# EAGLE design Solarduino (EAGLE 7.3.0)
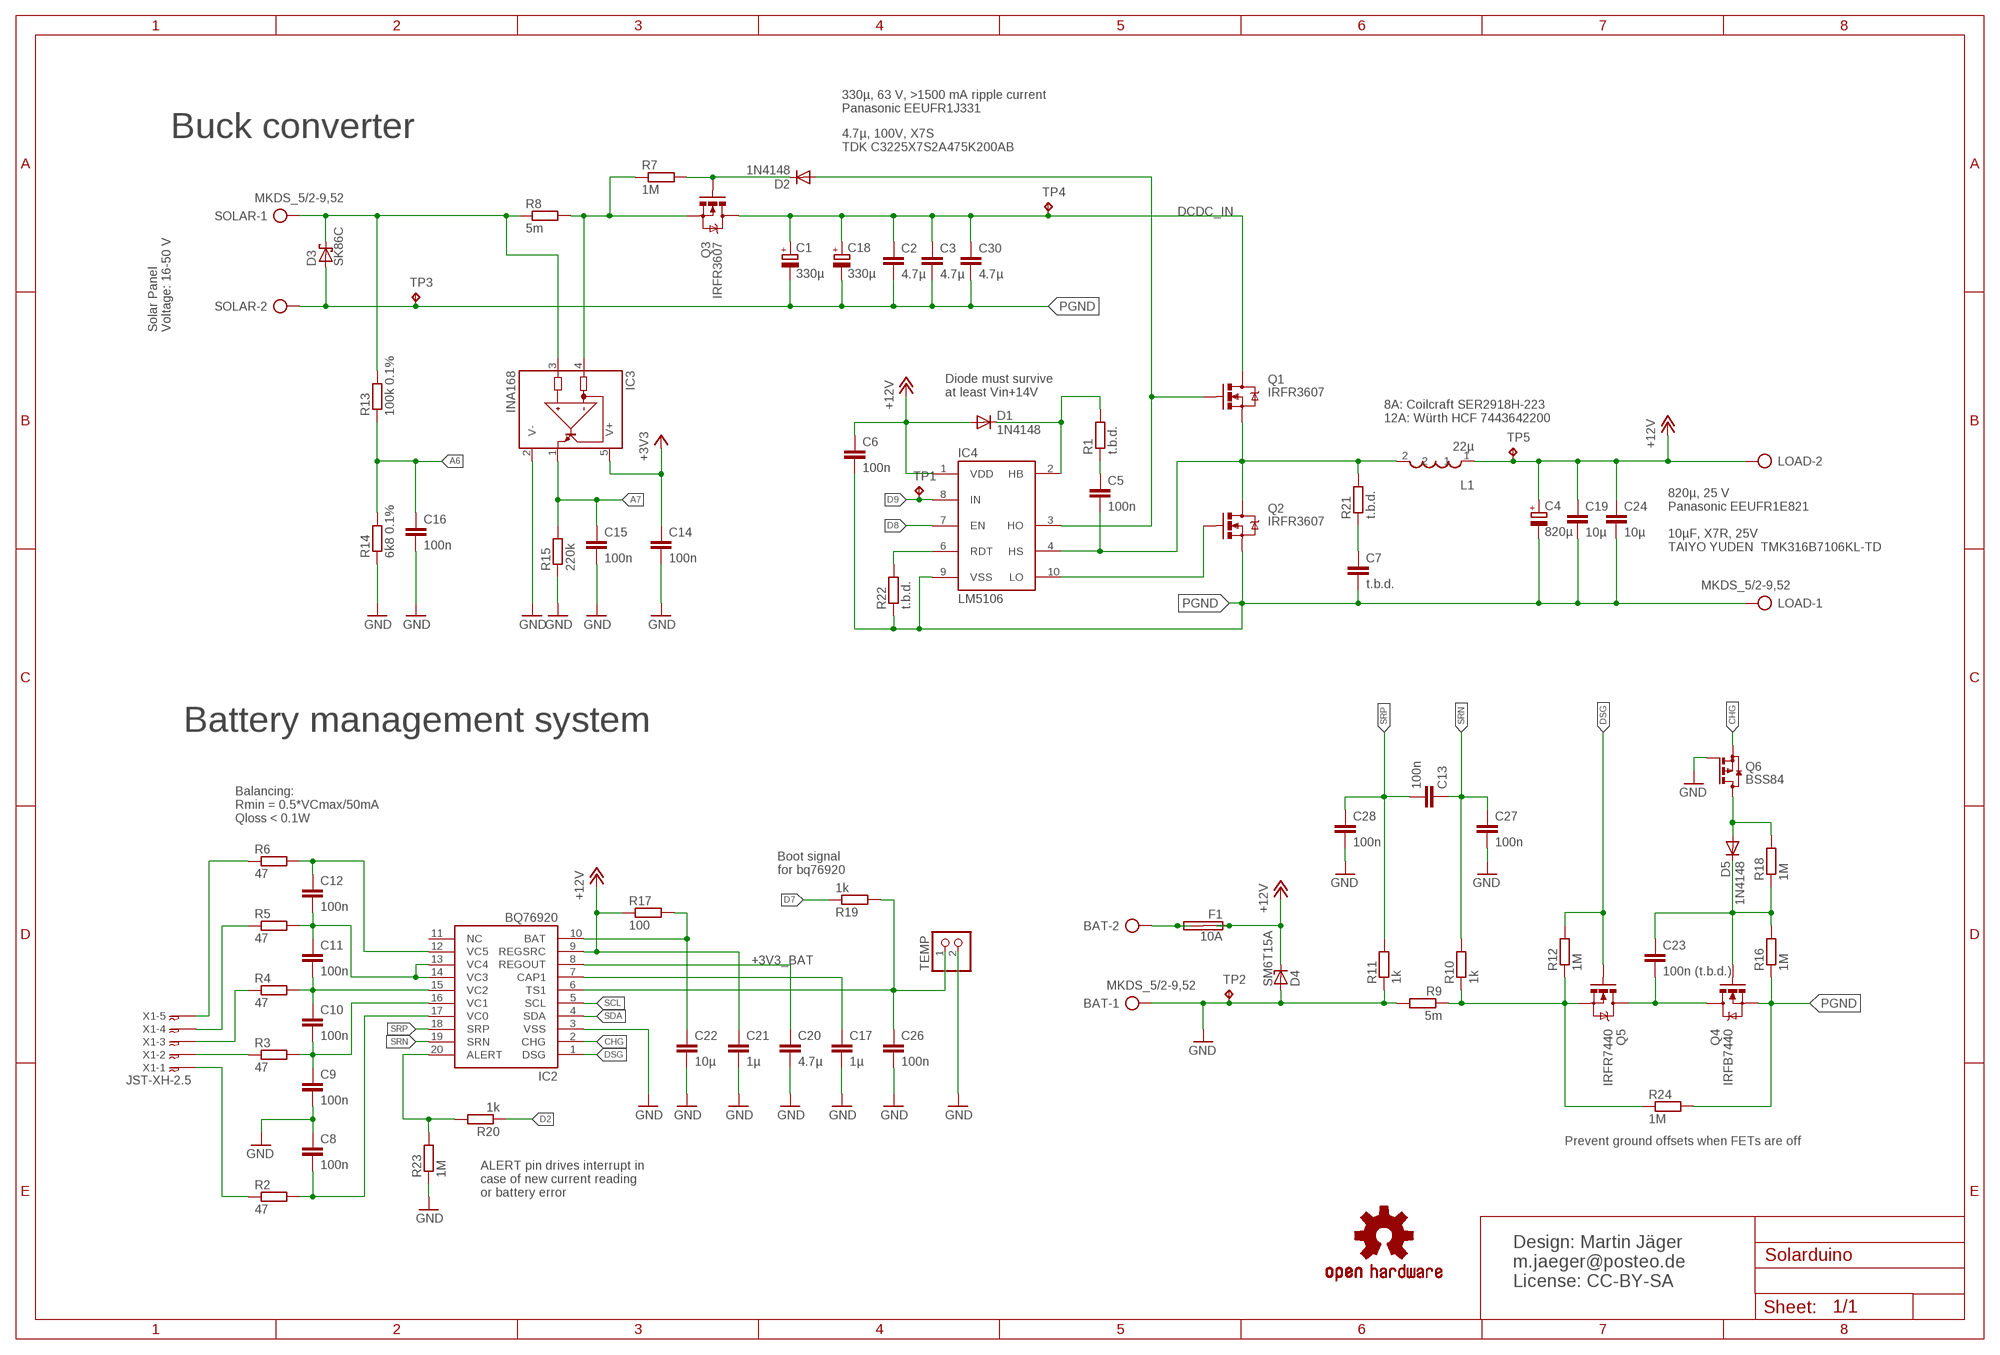
[diagram p0: schematic, sheet 1, part 1 of 2]
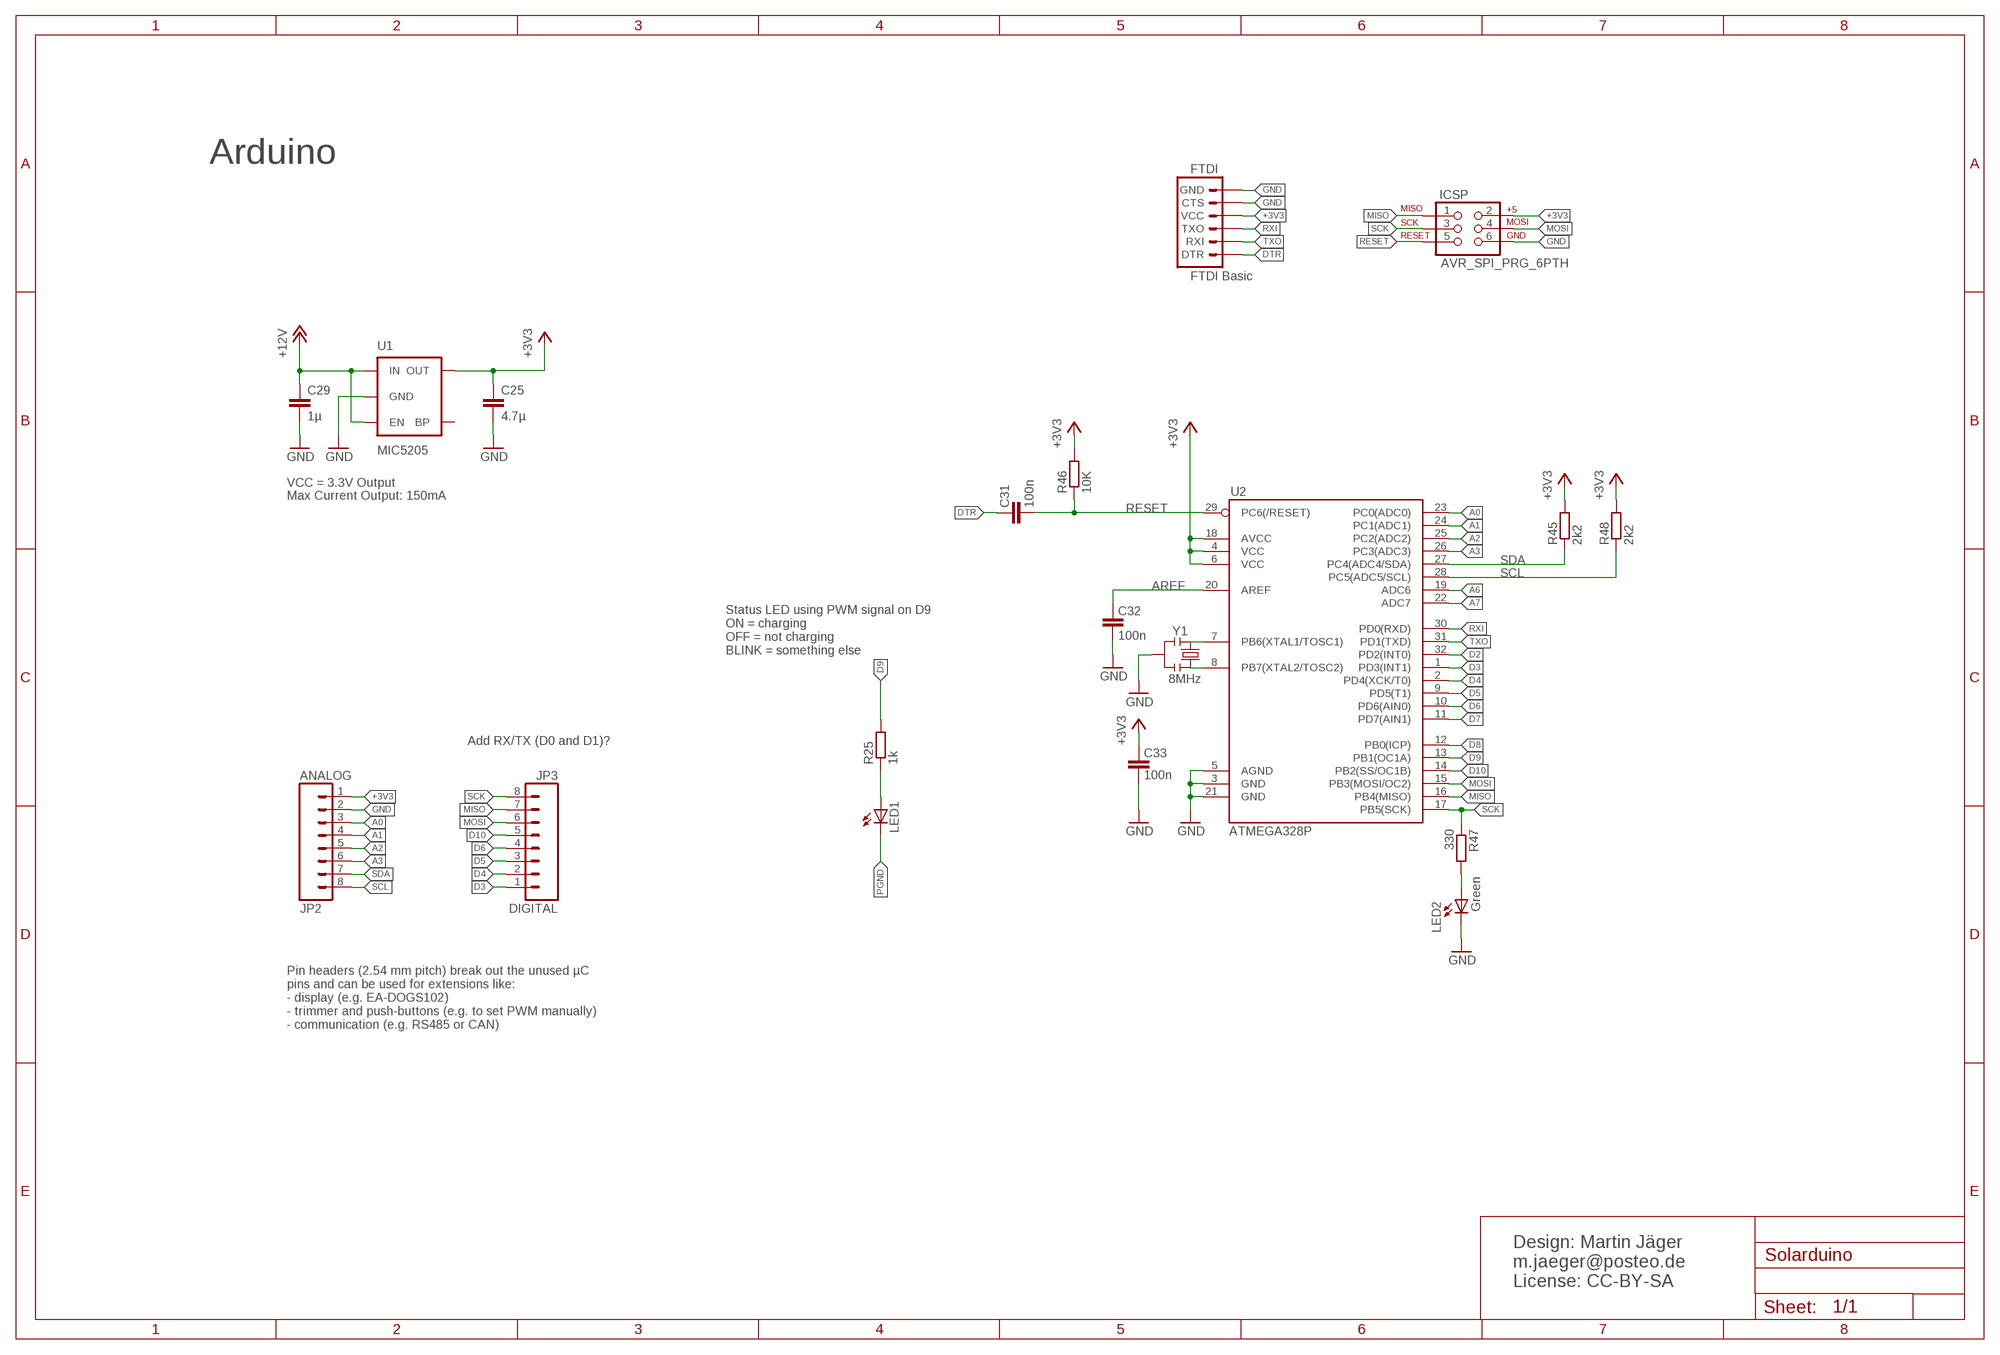
[diagram p1: schematic, sheet 1, part 2 of 2]

## Parts
BAT  MKDS_5/2-9,52  [MKDS_5/2-952]
C1  330µ  CPOL-EUE5-13  [E5-13]
C2  4.7µ  C-EUC1210  [C1210]
C3  4.7µ  C-EUC1210  [C1210]
C4  820µ  CPOL-EUE5-10.5  [E5-10,5]
C5  100n  C-EUC0805  [C0805]
C6  100n  C-EUC0805  [C0805]
C7  t.b.d.  C-EUC0805  [C0805]
C8  100n  C-EUC0805  [C0805]
C9  100n  C-EUC0805  [C0805]
C10  100n  C-EUC0805  [C0805]
C11  100n  C-EUC0805  [C0805]
C12  100n  C-EUC0805  [C0805]
C13  100n  C-EUC0805  [C0805]
C14  100n  C-EUC0805  [C0805]
C15  100n  C-EUC0805  [C0805]
C16  100n  C-EUC0805  [C0805]
C17  1µ  C-EUC0805  [C0805]
C18  330µ  CPOL-EUE5-13  [E5-13]
C19  10µ  C-EUC1206  [C1206]
C20  4.7µ  C-EUC0805  [C0805]
C21  1µ  C-EUC0805  [C0805]
C22  10µ  C-EUC1206  [C1206]
C23  100n (t.b.d.)  C-EUC0805  [C0805]
C24  10µ  C-EUC1206  [C1206]
C25  4.7µ  C-EUC0805  [C0805]
C26  100n  C-EUC0805  [C0805]
C27  100n  C-EUC0805  [C0805]
C28  100n  C-EUC0805  [C0805]
C29  1µ  C-EUC0805  [C0805]
C30  4.7µ  C-EUC1210  [C1210]
C31  100n  C-EUC0805  [C0805]
C32  100n  C-EUC0805  [C0805]
C33  100n  C-EUC0805  [C0805]
D1  1N4148  DIODE-SOD323-R  [SOD323-R]
D2  1N4148  DIODE-SOD323-R  [SOD323-R]
D3  SK86C  SCHOTTKY-DIODESMC  [SMC]
D4  SM6T15A  ZENER-DIODESMB  [SMB]
D5  1N4148  DIODE-SOD323-R  [SOD323-R]
F1  10A  SHK20Q  [SHK20Q]
FTDI  FTDI Basic  ARDUINO_SERIAL_PROGRAMPTH  [1X06]
IC2  BQ76920  [TSSOP20]
IC3  INA168  [SOT23-5]
IC4  LM5106  [VSSOP10]
ICSP  AVR_SPI_PRG_6PTH  [2X3]
JP2  ANALOG  M08  [1X08_ROUND]
JP3  DIGITAL  M08  [1X08_ROUND]
L1  22µ  WE-HCF_2818_7443643300  [WE-HCF_2818_7443643300]
LED1  LED3MM  [LED3MM]
LED2  Green  LED  [0603-LED-ALT1]
LOAD  MKDS_5/2-9,52  [MKDS_5/2-952]
N1  OSHW-LOGOM  [OSHW-LOGO-M]
Q1  IRFR3607  MOSFET-NCHANNELFDD8780  [DPAK]
Q2  IRFR3607  MOSFET-NCHANNELFDD8780  [DPAK]
Q3  IRFR3607  MOSFET-NCHANNELFDD8780  [DPAK]
Q4  IRFB7440  MOSFET-NCHANNELFDD8780  [DPAK]
Q5  IRFR7440  MOSFET-NCHANNELFDD8780  [DPAK]
Q6  BSS84  [SOT23]
R1  t.b.d.  R-EU_R0805  [R0805]
R2  47  R-EU_R2512  [R2512]
R3  47  R-EU_R2512  [R2512]
R4  47  R-EU_R2512  [R2512]
R5  47  R-EU_R2512  [R2512]
R6  47  R-EU_R2512  [R2512]
R7  1M  R-EU_R0805  [R0805]
R8  5m  R-EU_R2512  [R2512]
R9  5m  R-EU_R2512  [R2512]
R10  1k  R-EU_R0805  [R0805]
R11  1k  R-EU_R0805  [R0805]
R12  1M  R-EU_R0805  [R0805]
R13  100k 0.1%  R-EU_R0805  [R0805]
R14  6k8 0.1%  R-EU_R0805  [R0805]
R15  220k  R-EU_R0805  [R0805]
R16  1M  R-EU_R0805  [R0805]
R17  100  R-EU_R0805  [R0805]
R18  1M  R-EU_R0805  [R0805]
R19  1k  R-EU_R0805  [R0805]
R20  1k  R-EU_R0805  [R0805]
R21  t.b.d.  R-EU_R2010  [R2010]
R22  t.b.d.  R-EU_R0805  [R0805]
R23  1M  R-EU_R0805  [R0805]
R24  1M  R-EU_R0805  [R0805]
R25  1k  R-EU_R0805  [R0805]
R45  2k2  R-EU_R0805  [R0805]
R46  10K  R-EU_R0805  [R0805]
R47  330  R-EU_R0805  [R0805]
R48  2k2  R-EU_R0805  [R0805]
SOLAR  MKDS_5/2-9,52  [MKDS_5/2-952]
TEMP  PINHD-1X2/90  [1X02/90]
TP1  TPPAD1-13  [P1-13]
TP2  TPPAD1-13  [P1-13]
TP3  TPPAD1-13  [P1-13]
TP4  TPPAD1-13  [P1-13]
TP5  TPPAD1-13  [P1-13]
U1  MIC5205  V_REG_LDOSMD  [SOT23-5]
U2  ATMEGA328P  ATMEGA168  [TQFP32-08]
X1  JST-XH-2.5  05-JST-S5B-XH-A  [S5B-XH]
Y1  8MHz  RESONATORSMD  [RESONATOR-SMD]

## Nets
+3V3: C14.1 C25.1 C33.2 FTDI.4(VCC) IC3.5(V+) ICSP.2 JP2.1 R45.2 R46.2 R48.2 U1.5(OUT) U2.4(VCC) U2.6(VCC) U2.18(AVCC)
+3V3_BAT: C20.1 IC2.8(REGOUT)
+12V [VIN]: C4.+ C6.1 C19.1 C21.1 C24.1 C29.1 D1.A D4.C F1.1A F1.1B IC2.9(REGSRC) IC4.1(VDD) L1.1 LOAD.2 R17.1 TP5.TP U1.1(IN) U1.3(EN)
A0: JP2.3 U2.23(PC0(ADC0))
A1: JP2.4 U2.24(PC1(ADC1))
A2: JP2.5 U2.25(PC2(ADC2))
A3: JP2.6 U2.26(PC3(ADC3))
A6: C16.1 R13.1 R14.2 U2.19(ADC6)
A7: C15.1 IC3.1(OUT) R15.2 U2.22(ADC7)
ALERT: IC2.20(ALERT) R20.2 R23.2
AREF: C32.2 U2.20(AREF)
BAT+: BAT.2 F1.2A F1.2B
CHG: IC2.2(CHG) Q6.2(S)
D2: R20.1 U2.32(PD2(INT0))
D3: JP3.1 U2.1(PD3(INT1))
D4: JP3.2 U2.2(PD4(XCK/T0))
D5: JP3.3 U2.9(PD5(T1))
D6: JP3.4 U2.10(PD6(AIN0))
D7: R19.1 U2.11(PD7(AIN1))
D8: IC4.7(EN) U2.12(PB0(ICP))
D9: IC4.8(IN) R25.2 TP1.TP U2.13(PB1(OC1A))
D10: JP3.5 U2.14(PB2(SS/OC1B))
D_LS: C5.2 IC4.4(HS) L1.2 Q1.3(S) Q2.4(D) R21.2
DCDC_IN: C1.+ C2.1 C3.1 C18.+ C30.1 Q1.4(D) Q3.4(D) TP4.TP
DSG: IC2.1(DSG) Q5.1(G) R12.2
DTR: C31.2 FTDI.1(DTR)
GND [power]: BAT.1 C8.1 C9.2 C14.2 C15.2 C16.2 C17.2 C20.2 C21.2 C22.2 C25.2 C26.2 C27.2 C28.2 C29.2 C32.1 C33.1 D4.A FTDI.5(CTS) FTDI.6(GND) IC2.3(VSS) IC3.2(V-) ICSP.6 JP2.2 LED2.C Q6.1(G) R9.2 R11.1 R14.1 R15.1 R23.1 TEMP.2 TP2.TP U1.2(GND) U2.3(GND) U2.5(AGND) U2.21(GND) Y1.2
MISO: ICSP.1 JP3.7 U2.16(PB4(MISO))
MOSI: ICSP.4 JP3.6 U2.15(PB3(MOSI/OC2))
N$1: IC3.4(IN-) Q3.3(S) R7.1 R8.2
N$2: IC4.10(LO) Q2.1(G)
N$3: LED2.A R47.2
N$4: D2.A IC4.3(HO) Q1.1(G)
N$5: D1.C IC4.2(HB) R1.2
N$6: C23.1 D5.C Q4.1(G) R16.2 R18.1
N$7: R3.1 X1.P$2
N$8: C5.1 R1.1
N$9: C22.1 IC2.10(BAT) R17.2
N$10: C10.1 C11.2 IC2.15(VC2) R4.2
N$11: C11.1 C12.2 IC2.13(VC4) IC2.14(VC3) R5.2
N$12 [power]: R2.1 X1.P$1
N$13: C12.1 IC2.12(VC5) R6.2
N$14: C8.2 IC2.17(VC0) R2.2
N$15: R4.1 X1.P$3
N$16: C9.1 C10.2 IC2.16(VC1) R3.2
N$17: R5.1 X1.P$4
N$18: D5.A Q6.3(D) R18.2
N$19: D2.C Q3.1(G) R7.2
N$20: U2.8(PB7(XTAL2/TOSC2)) Y1.3
N$21: U2.7(PB6(XTAL1/TOSC1)) Y1.1
N$22 [power]: Q5.3(S) R9.1 R10.1 R12.1 R24.1
N$23 [power]: C23.2 Q4.4(D) Q5.4(D)
N$24: IC4.6(RDT) R22.2
N$25 [power]: R6.1 X1.P$5
N$26: C17.1 IC2.7(CAP1)
N$27: C7.1 R21.1
N$28: LED1.A R25.1
NTC: C26.1 IC2.6(TS1) R19.2 TEMP.1
PGND [power]: C1.- C2.2 C3.2 C4.- C6.2 C7.2 C18.- C19.2 C24.2 C30.2 D3.A IC4.9(VSS) LED1.K(C) LOAD.1 Q2.3(S) Q4.3(S) R16.1 R22.1 R24.2 SOLAR.2 TP3.TP
RESET: C31.1 ICSP.5 R46.1 U2.29(PC6(/RESET))
RXI: FTDI.3(TXO) U2.30(PD0(RXD))
SCK: ICSP.3 JP3.8 R47.1 U2.17(PB5(SCK))
SCL: IC2.5(SCL) JP2.8 R48.1 U2.28(PC5(ADC5/SCL))
SDA: IC2.4(SDA) JP2.7 R45.1 U2.27(PC4(ADC4/SDA))
SOLAR+: D3.C IC3.3(IN+) R8.1 R13.2 SOLAR.1
SRN: C13.1 C27.1 IC2.19(SRN) R10.2
SRP: C13.2 C28.1 IC2.18(SRP) R11.2
TXO: FTDI.2(RXI) U2.31(PD1(TXD))
Unconnected: IC2.11(NC) U1.4(BP)

## Notes on the sheet
- 330µ, 63 V, >1500 mA ripple current
  Panasonic EEUFR1J331
- Buck converter
- 4.7µ, 100V, X7S
  TDK C3225X7S2A475K200AB
- Arduino
- Solar Panel
  Voltage: 16-50 V
- Diode must survive
  at least Vin+14V
- 8A: Coilcraft SER2918H-223
  12A: Würth HCF 7443642200
- VCC = 3.3V Output
- Max Current Output: 150mA
- 820µ, 25 V
  Panasonic EEUFR1E821
  
  10µF, X7R, 25V
  TAIYO YUDEN  TMK316B7106KL-TD
- Status LED using PWM signal on D9
  ON = charging
  OFF = not charging
  BLINK = something else
- Battery management system
- Add RX/TX (D0 and D1)?
- Balancing:
  Rmin = 0.5*VCmax/50mA
  Qloss < 0.1W
- Boot signal
  for bq76920
- Pin headers (2.54 mm pitch) break out the unused µC
  pins and can be used for extensions like:
  - display (e.g. EA-DOGS102)
  - trimmer and push-buttons (e.g. to set PWM manually)
  - communication (e.g. RS485 or CAN)
- Prevent ground offsets when FETs are off
- ALERT pin drives interrupt in 
  case of new current reading
  or battery error
- Design: Martin Jäger
  m.jaeger@posteo.de
  License: CC-BY-SA
- Design: Martin Jäger
  m.jaeger@posteo.de
  License: CC-BY-SA

## Library data of the parts
BAT LOAD SOLAR = resolut:MKDS_5/2-: MKDS 5/2-6,35 Source: PHOENIX CONTACT; OC_FARNELL: unknown
C1 C18 = rcl:CPOL-EU: POLARIZED CAPACITOR, European symbol; MF: PANASONIC ELECTRONIC COMPONENTS; MPN: EEUFR1J331B; OC_FARNELL: 2079305
C2 C3 C30 = rcl:C-EU: CAPACITOR, European symbol; MF: TDK; MPN: C3225X7S2A475K200AB; OC_FARNELL: 2211203
C4 = rcl:CPOL-EU: POLARIZED CAPACITOR, European symbol; MF: PANASONIC ELECTRONIC COMPONENTS; MPN: EEUFR1E821B; OC_FARNELL: 1800653
C5-C16 C23 C26-C28 C31 C32 = rcl:C-EU: CAPACITOR, European symbol; MF: AVX; MPN: 08055C104KAT2A; OC_FARNELL: 499687
C17 C21 C29 = rcl:C-EU: CAPACITOR, European symbol; MF: AVX; MPN: 08053C105KAT2A; OC_FARNELL: 1658877
C19 C22 C24 = rcl:C-EU: CAPACITOR, European symbol; MF: TAIYO YUDEN; MPN: TMK316B7106KL-TD; OC_FARNELL: 2113073
C20 C25 = rcl:C-EU: CAPACITOR, European symbol; MF: AVX; MPN: 0805YC475KAT2A; OC_FARNELL: 1657937
C33 = rcl:C-EU: CAPACITOR, European symbol; MF: AVX; MPN: 08055C104JAT2A; OC_FARNELL: 1740673
D1 D2 D5 = diode:DIODE-: DIODE; MF: VISHAY SEMICONDUCTOR; MPN: 1N4148WS-E3-08; OC_FARNELL: 2164233
D3 = diode:SCHOTTKY-DIODE: Schottky Diode; MF: TAIWAN SEMICONDUCTOR; MPN: SK56C; OC_FARNELL: 1299292
D4 = diode:ZENER-DIODE: Z-Diode; MF: MULTICOMP; MPN: P6SMBJ15A; OC_FARNELL: 9381589
F1 = fuse:SHK20Q: FUSE HOLDER 5 x 20 mm, SH contact, E1207 Buerklin 64G6061; OC_FARNELL: unknown; OC_NEWARK: unknown
FTDI = SparkFun:ARDUINO_SERIAL_PROGRAM; MF: MULTICOMP; MPN: 2212S-06SG-85; OC_FARNELL: 1593462
IC2 = resolut:BQ76920; OC_FARNELL: unknown
IC3 = burr-brown:INA168: High-Side Measurement Current Shunt Monitor; MF: TEXAS INSTRUMENTS; MPN: INA168NA/250.; OC_FARNELL: 4375737; OC_NEWARK: 35C1744
IC4 = resolut:LM5106: 100V Half Bridge Gate Driver with Programmable Dead-Time; MF: TEXAS INSTRUMENTS; MPN: LM5106MM/NOPB; OC_FARNELL: 1312793
ICSP = SparkFun-Connectors:AVR_SPI_PRG_6: AVR ISP 6 Pin This is the reduced ISP connector for AVR programming. Common on Arduino. This footprint will take up less PCB space and can be used with a 10-pin to 6-pin adapter such as SKU: BOB-08508 **Special note about "TEST_POINT" package. The stop mask is on the top side, so if you want your programming test points to be on the bottom of your board, make sure to place this package on the bottom side of the board. This also ensure that the orientation to program from the bottom side will be correct.; OC_FARNELL: unknown
JP2 JP3 = SparkFun-Connectors:M08: Header 8 Standard 8-pin 0.1" header. Use with straight break away headers (SKU : PRT-00116), right angle break away headers (PRT-00553), swiss pins (PRT-00743), machine pins (PRT-00117), and female headers (PRT-00115).; OC_FARNELL: unknown
L1 = PowerMagnetics:WE-HCF_2818_7443643300: SMD High Current Inductor -Saturation current up to 75A -Very low core losses(MnZn) -Magnetically shielded -Operating temprature:-40°Cto 125°C -Current capability up to 32A --Storage inductor for high efficiency DC/DC converters --Single and polyphase buck converters --Filter for audio applications --Optimized for high current boost applications <http://katalog.we-online.de/media/images/eisos/IndHCF_pf2.jpg> Details see: http://katalog.we-online.de/en/pbs/WE-HCF Created by Dan Xu 2014-07-14 2014 (C) Würth Elektronik; MF: COILCRAFT; MPN: SER2918H-223KL; OC_FARNELL: 2288918
LED1 = led:LED: LED OSRAM: - CHIPLED LG R971, LG N971, LY N971, LG Q971, LY Q971, LO R971, LY R971 LH N974, LH R974 LS Q976, LO Q976, LY Q976 LO Q996 - Hyper CHIPLED LW Q18S LB Q993, LB Q99A, LB R99A - SideLED LS A670, LO A670, LY A670, LG A670, LP A670 LB A673, LV A673, LT A673, LW A673 LH A674 LY A675 LS A676, LA A676, LO A676, LY A676, LW A676 LS A679, LY A679, LG A679 - Hyper Micro SIDELED® LS Y876, LA Y876, LO Y876, LY Y876 LT Y87S - SmartLED LW L88C, LW L88S LB L89C, LB L89S, LG L890 LS L89K, LO L89K, LY L89K LS L896, LA L896, LO L896, LY L896 - TOPLED LS T670, LO T670, LY T670, LG T670, LP T670 LSG T670, LSP T670, LSY T670, LOP T670, LYG T670 LG T671, LOG T671, LSG T671 LB T673, LV T673, LT T673, LW T673 LH T674 LS T676, LA T676, LO T676, LY T676, LB T676, LH T676, LSB T676, LW T676 LB T67C, LV T67C, LT T67C, LS T67K, LO T67K, LY T67K, LW E67C LS E67B, LA E67B, LO E67B, LY E67B, LB E67C, LV E67C, LT E67C LW T67C LS T679, LY T679, LG T679 LS T770, LO T770, LY T770, LG T770, LP T770 LB T773, LV T773, LT T773, LW T773 LH T774 LS E675, LA E675, LY E675, LS T675 LS T776, LA T776, LO T776, LY T776, LB T776 LHGB T686 LT T68C, LB T68C - Hyper Mini TOPLED® LB M676 - Mini TOPLED Santana® LG M470 LS M47K, LO M47K, LY M47K Source: http://www.osram.convergy.de LUXEON: - LUMILED® LXK2-PW12-R00, LXK2-PW12-S00, LXK2-PW14-U00, LXK2-PW14-V00 LXK2-PM12-R00, LXK2-PM12-S00, LXK2-PM14-U00 LXK2-PE12-Q00, LXK2-PE12-R00, LXK2-PE12-S00, LXK2-PE14-T00, LXK2-PE14-U00 LXK2-PB12-K00, LXK2-PB12-L00, LXK2-PB12-M00, LXK2-PB14-N00, LXK2-PB14-P00, LXK2-PB14-Q00 LXK2-PR12-L00, LXK2-PR12-M00, LXK2-PR14-Q00, LXK2-PR14-R00 LXK2-PD12-Q00, LXK2-PD12-R00, LXK2-PD12-S00 LXK2-PH12-R00, LXK2-PH12-S00 LXK2-PL12-P00, LXK2-PL12-Q00, LXK2-PL12-R00 Source: www.luxeon.com KINGBRIGHT: KA-3528ASYC Source: www.kingbright.com; MF: MULTICOMP; MPN: MCL034GD; OC_FARNELL: 1581114
LED2 = Testing:LED: LEDs Standard schematic elements and footprints for 5mm, 3mm, 1206, and 0603 sized LEDs. 5mm - Spark Fun Electronics SKU : COM-00529 (and others); MF: MULTICOMP; MPN: MCL034GD; OC_FARNELL: 1581114
N1 = resolut:OSHW-LOGO: Open Source Hardware Logo This logo indicates the piece of hardware it is found on incorporates a OSHW license and/or adheres to the definition of open source hardware found here: http://freedomdefined.org/OSHW; OC_FARNELL: unknown
Q1-Q3 = SparkFun-DiscreteSemi:MOSFET-NCHANNEL: Common NMOSFET Parts MFG P/N Store ID Prod ID FDD8780 TRANS-09984 SI7820DN TRANS-11055 FDS6630A IC-08089 2N7002PW TRANS-11151 FQP30N06L COM-10213 TRANS-10060 BSS123LT1G TRANS-08345 BSS138 TRANS-00830 BS170 2N7000; MF: INTERNATIONAL RECTIFIER; MPN: IRFR3607PBF; OC_FARNELL: 1602230; PROD_ID: TRANS-09984
Q4 Q5 = SparkFun-DiscreteSemi:MOSFET-NCHANNEL: Common NMOSFET Parts MFG P/N Store ID Prod ID FDD8780 TRANS-09984 SI7820DN TRANS-11055 FDS6630A IC-08089 2N7002PW TRANS-11151 FQP30N06L COM-10213 TRANS-10060 BSS123LT1G TRANS-08345 BSS138 TRANS-00830 BS170 2N7000; MF: INTERNATIONAL RECTIFIER; MPN: IRFR7440TRPBF; OC_FARNELL: 2253806; PROD_ID: TRANS-09984
Q6 = transistor-small-signal:BSS84: P-CHANNEL MOS FET; MF: MULTICOMP; MPN: BSS84-7-F; OC_FARNELL: 2306397
R1 R10 R11 R19 R20 R22 R25 R45 R48 = rcl:R-EU_: RESISTOR, European symbol; MF: BOURNS; MPN: CR0805-FX-1001ELF; OC_FARNELL: 2008380
R2-R6 = rcl:R-EU_: RESISTOR, European symbol; MF: MULTICOMP; MPN: MCHP122WF470JT4E; OC_FARNELL: 2426571
R7 R12 R16 R18 R23 R24 = rcl:R-EU_: RESISTOR, European symbol; MF: BOURNS; MPN: CR0805-FX-1004ELF.; OC_FARNELL: 1795166
R8 R9 = rcl:R-EU_: RESISTOR, European symbol; MF: BOURNS; MPN: CRF2512-FX-R005ELF; OC_FARNELL: 2008327
R13 = rcl:R-EU_: RESISTOR, European symbol; MF: PANASONIC ELECTRONIC COMPONENTS; MPN: ERA6AEB104V; OC_FARNELL: 1577686
R14 = rcl:R-EU_: RESISTOR, European symbol; MF: PANASONIC ELECTRONIC COMPONENTS; MPN: ERA6AEB682V; OC_FARNELL: 1577671
R15 = rcl:R-EU_: RESISTOR, European symbol; MF: BOURNS; MPN: CHV0805-FX-2203ELF; OC_FARNELL: 2470919
R17 = rcl:R-EU_: RESISTOR, European symbol; MF: BOURNS; MPN: CR0805-FX-1000-ELF; OC_FARNELL: 1795256
R21 = rcl:R-EU_: RESISTOR, European symbol; MF: BOURNS; MPN: CRM2010-JW-2R2ELF; OC_FARNELL: 1865253
R46 = rcl:R-EU_: RESISTOR, European symbol; MF: BOURNS; MPN: CR0805-FX-1002ELF; OC_FARNELL: 1612522
R47 = rcl:R-EU_: RESISTOR, European symbol; MF: BOURNS; MPN: CR0805-FX-3300ELF; OC_FARNELL: 1853208
TEMP = pinhead:PINHD-1X2: PIN HEADER; MF: MULTICOMP; MPN: MC34745; OC_FARNELL: 1593426
TP1-TP5 = testpad:TP: Test pad
U1 = SparkFun:V_REG_LDO: Voltage Regulator LDO Standard 150mA LDO voltage regulator in SOT-23 layout. Micrel part MIC5205. BP (by-pass) pin is used to lower output noise with 470pF cap.; MF: MICREL SEMICONDUCTOR; MPN: MIC5205-3.3YM5 TR; OC_FARNELL: 1663083
U2 = SparkFun:ATMEGA168; MF: ATMEL; MPN: ATMEGA328P-AU; OC_FARNELL: 1715486
X1 = resolut:05-JST: JST CONNECTOR; MF: JST (JAPAN SOLDERLESS TERMINALS); MPN: S5B-XH-A (LF)(SN); OC_FARNELL: 1516293
Y1 = Testing:RESONATOR: Resonator Small SMD resonator. This is the itty bitty 10/20MHz resonators with built in caps. CSTCE10M0G55 and CSTCE20M0V53. Footprint for SMD has been used in SFE production for years, and does work okay. 1:1 is an attempt to get larger fillets on the sides so it will be easier to inspect these solders in our AOI machine. The pads have been minimized to match the actual metal under the resonator. To see this relation, it includes an image import of the bottom side of the component. Imported to scale on layer 200.; MF: MURATA; MPN: CSTCE8M00G55-R0; OC_FARNELL: 2443270

## Net classes
0 default: width 0.305 mm, drill 0.5 mm, clearance 0.152 mm
1 power: width 0.305 mm, drill 0.5 mm, clearance 0.152 mm
2 VIN: width 0.305 mm, drill 0.5 mm, clearance 0.152 mm

## Board
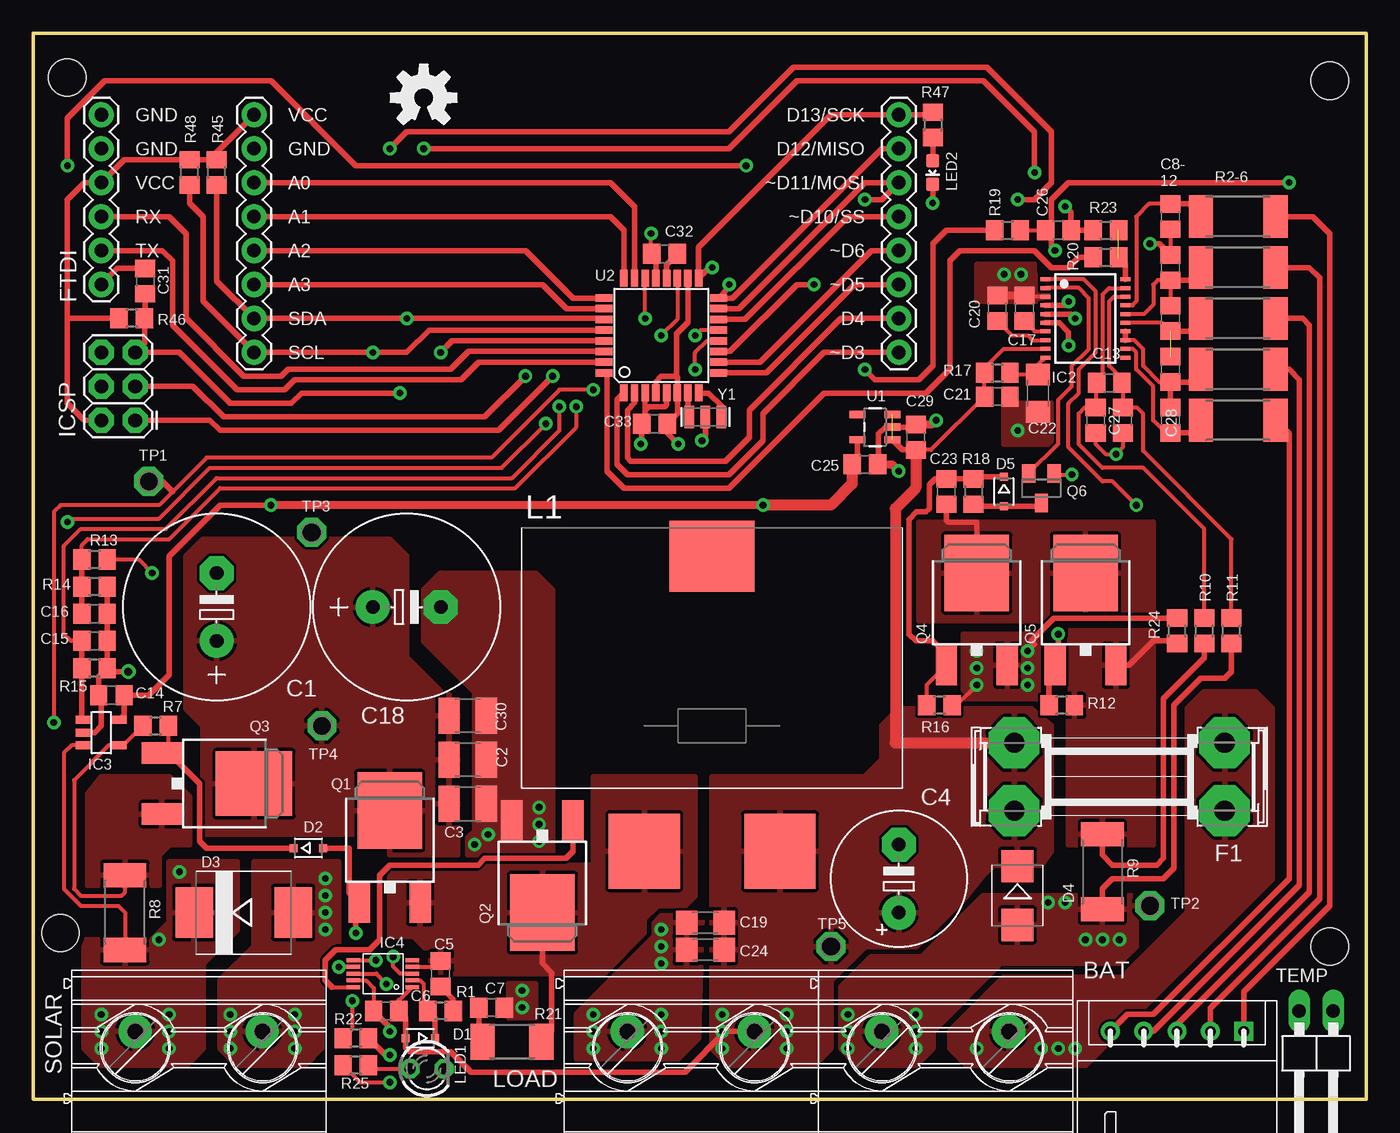
[diagram p2: board, top side]
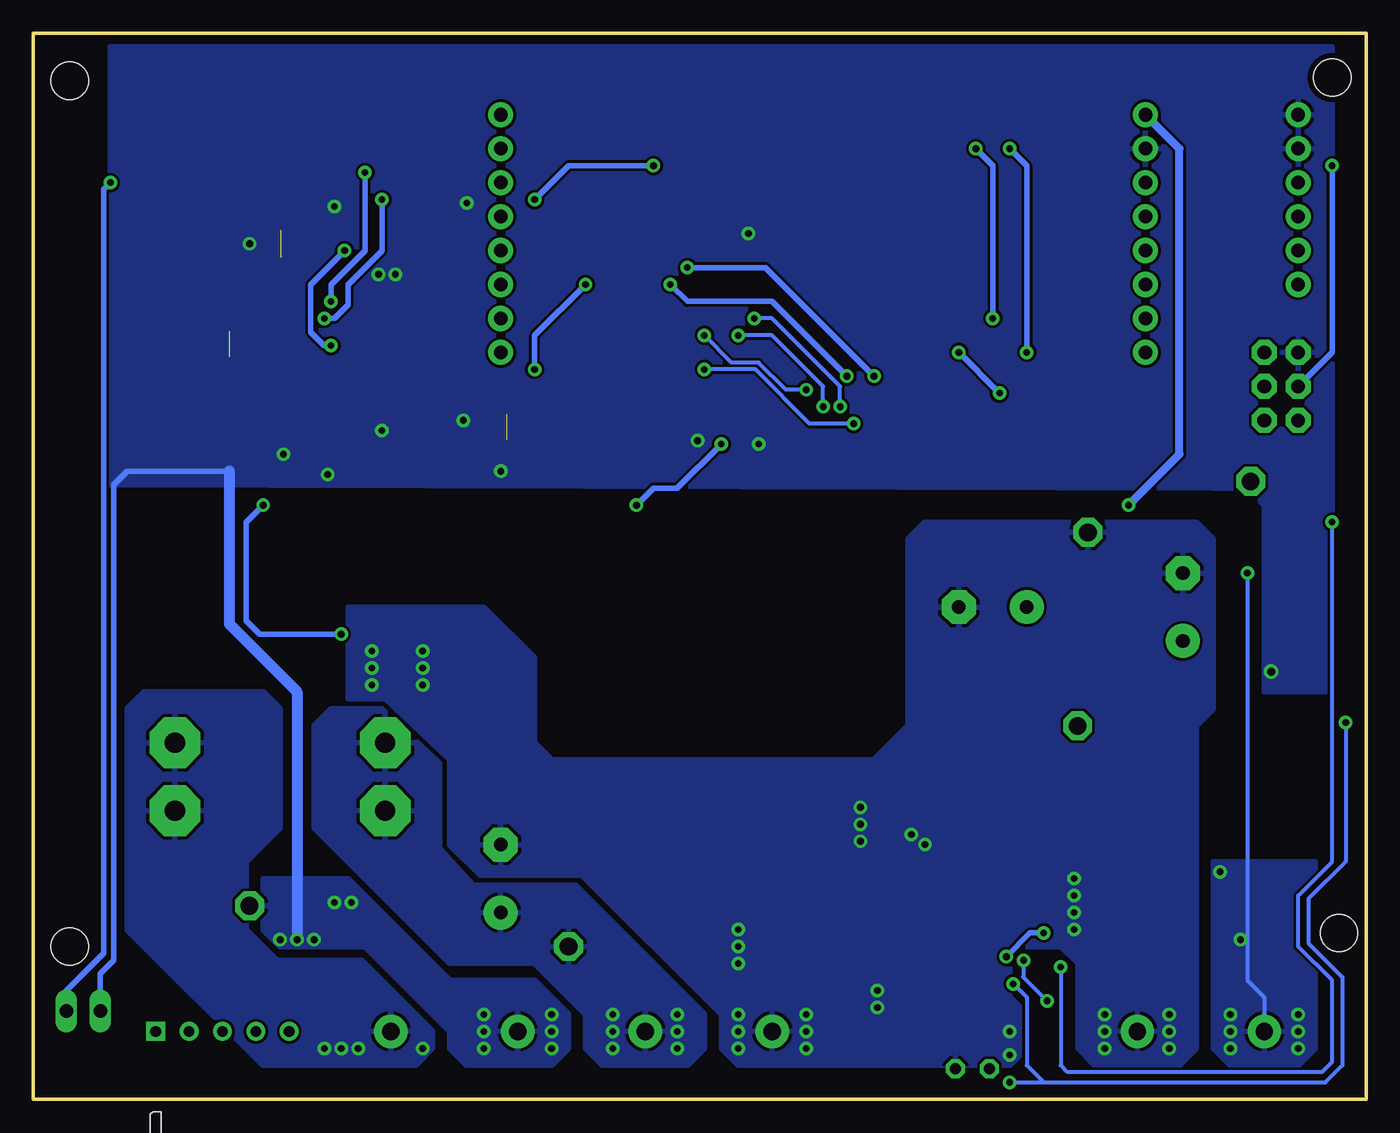
[diagram p3: board, bottom side, seen from below]

Size 99.75 x 79.75 mm. Coordinates in mm from the lower left corner, seen from the top.
Outline: 99.75,79.75 0,79.75 0,0 99.75,0 99.75,79.75
Copper layers (1*16): Top 0.035mm / dielectric 1.5mm / Bottom 0.035mm
Design rules "SparkFun-2-layer *": minimum track width 7mil, minimum drill 15mil, track to track 8mil, track to pad 8mil, pad to pad 8mil, via to via 8mil, smd to smd 8mil, copper to edge 16mil, drill to drill 8mil, minimum pad ring 12mil, minimum via ring 10mil, stop-mask expansion 4mil, vias tented up to drill 25mil, thermal gap 10mil
Holes 2.8 mm at 2.03,12.45 97.03,11.43 97.03,76.2 2.54,76.45

### Footprints (pad centres in the part's own frame; a part is rotated, then mirrored left to right if it is on the bottom)
MKDS_5/2-952 = drill 1.3 pad 2.5: 1 0,0; 2 9.5,0
E5-13 = drill 1.016 pad 2.54: + -2.54,0 | drill 1.016 pad 2.54 octagon: - 2.54,0
C1210 = smd 1.6 x 2.7: 1 -1.4,0; 2 1.4,0
E5-10,5 = drill 1.016 pad 2.54: + -2.54,0 | drill 1.016 pad 2.54 octagon: - 2.54,0
C0805 = smd 1.3 x 1.5: 1 -0.95,0; 2 0.95,0
C1206 = smd 1.6 x 1.8: 1 -1.4,0; 2 1.4,0
SOD323-R = smd 0.6 x 0.6: A 1.1,0; C -1.1,0
SMC = smd 2.8 x 3.8: A 3.7,0; C -3.7,0
SMB = smd 2.4 x 2.4: A 2.2,0; C -2.2,0
SHK20Q = drill 1.5 pad 3.81 octagon: 1A -7.874,2.54; 1B -7.874,-2.54; 2A 7.874,2.54; 2B 7.874,-2.54
1X06 = drill 1.016 pad 1.88: 1 0,0; 2 2.54,0; 3 5.08,0; 4 7.62,0; 5 10.16,0; 6 12.7,0
TSSOP20 = smd 0.3 x 0.75: 1 -2.925,-3; 2 -2.275,-3; 3 -1.625,-3; 4 -0.975,-3; 5 -0.325,-3; 6 0.325,-3; 7 0.975,-3; 8 1.625,-3; 9 2.275,-3; 10 2.925,-3; 11 2.925,3; 12 2.275,3; 13 1.625,3; 14 0.975,3; 15 0.325,3; 16 -0.325,3; 17 -0.975,3; 18 -1.625,3; 19 -2.275,3; 20 -2.925,3
SOT23-5 = smd 0.6 x 1.2: 1 -0.95,-1.306; 2 0,-1.306; 3 0.95,-1.306; 4 0.95,1.306; 5 -0.95,1.306
VSSOP10 = smd 1 x 0.3: 1 -2.2,1; 2 -2.2,0.5; 3 -2.2,0; 4 -2.2,-0.5; 5 -2.2,-1; 6 2.2,-1; 7 2.2,-0.5; 8 2.2,0; 9 2.2,0.5; 10 2.2,1
2X3 = drill 1.016 pad 1.88 octagon: 1 0,0; 2 0,2.54; 3 2.54,0; 4 2.54,2.54; 5 5.08,0; 6 5.08,2.54
1X08_ROUND = drill 1.016 pad 1.88: 1 0,0; 2 2.54,0; 3 5.08,0; 4 7.62,0; 5 10.16,0; 6 12.7,0; 7 15.24,0; 8 17.78,0
WE-HCF_2818_7443643300 = smd 5.33 x 5.59: 1 -5.075,14.465; 2 5.075,14.465 | smd 6.35 x 5.28: 3 0,-7.61
LED3MM = drill 0.813 octagon: A -1.27,0; K 1.27,0
0603-LED-ALT1 = smd 1 x 1: A 0,-0.877; C 0,0.877
DPAK = smd 1.6 x 3: 1 -2.28,-5.31; 3 2.28,-5.31 | smd 4.826 x 5.715: 4 0,1.588
SOT23 = smd 1 x 1.4: 1 -0.95,-1.1; 2 0.95,-1.1; 3 0,1.1
R0805 = smd 1.3 x 1.5: 1 -0.95,0; 2 0.95,0
R2512 = smd 1.8 x 3.2: 1 -2.8,0; 2 2.8,0
R2010 = smd 1.8 x 2.7: 1 -2.2,0; 2 2.2,0
1X02/90 = drill 1.016 long: 1 -1.27,-3.81; 2 1.27,-3.81
P1-13 = drill 1.321 pad 2.159 octagon: TP 0,0
SOT23-5' = smd 0.55 x 1.2: 1 -0.95,-1.3; 2 0,-1.3; 3 0.95,-1.3; 4 0.95,1.3; 5 -0.95,1.3
TQFP32-08 = smd 1.27 x 0.559: 1 -4.293,2.8; 2 -4.293,2; 3 -4.293,1.2; 4 -4.293,0.4; 5 -4.293,-0.4; 6 -4.293,-1.2; 7 -4.293,-2; 8 -4.293,-2.8; 17 4.293,-2.8; 18 4.293,-2; 19 4.293,-1.2; 20 4.293,-0.4; 21 4.293,0.4; 22 4.293,1.2; 23 4.293,2; 24 4.293,2.8 | smd 0.559 x 1.27: 9 -2.8,-4.293; 10 -2,-4.293; 11 -1.2,-4.293; 12 -0.4,-4.293; 13 0.4,-4.293; 14 1.2,-4.293; 15 2,-4.293; 16 2.8,-4.293; 25 2.8,4.293; 26 2,4.293; 27 1.2,4.293; 28 0.4,4.293; 29 -0.4,4.293; 30 -1.2,4.293; 31 -2,4.293; 32 -2.8,4.293
S5B-XH = drill 0.8 square: P$1 5,0 | drill 0.8: P$2 2.5,0; P$3 0,0; P$4 -2.5,0; P$5 -5,0
RESONATOR-SMD = smd 0.7 x 1.7: 1 -1.2,0; 2 0,0; 3 1.2,0

### Placement (x,y rotation side)
BAT  63.5,5.08 0 top
C1  13.72,36.83 90 top
C2  32.51,25.4 0 top
C3  32.51,22.1 0 top
C4  64.77,16.51 90 top
C5  30.48,9.4 90 top
C6  26.42,6.6 180 top
C7  34.29,6.86 0 top
C8  85.09,66.04 90 top
C9  85.09,62.23 90 top
C10  85.09,58.42 90 top
C11  85.09,54.61 90 top
C12  85.09,50.8 90 top
C13  80.52,53.59 0 top
C14  5.84,30.23 180 top
C15  4.57,34.29 0 top
C16  4.57,36.32 0 top
C17  74.17,59.18 90 top
C18  27.94,36.83 0 top
C19  50.29,13.21 180 top
C20  72.14,59.18 90 top
C21  72.14,52.58 0 top
C22  75.18,52.83 270 top
C23  68.33,45.47 270 top
C24  50.29,11.18 180 top
C25  62.23,47.5 0 top
C26  76.71,65.02 0 top
C27  79.5,50.8 270 top
C28  81.53,50.8 270 top
C29  66.04,49.53 90 top
C30  32.51,28.7 0 top
C31  8.38,61.21 90 top
C32  47.24,63.25 0 top
C33  46.48,50.55 0 top
D1  28.96,4.57 180 top
D2  20.57,18.8 0 top
D3  15.75,13.97 0 top
D4  73.66,15.24 270 top
D5  72.64,45.47 270 top
F1  81.28,24.13 0 top
FTDI  5.08,60.96 90 top
IC2  78.74,58.42 270 top
IC3  5.08,27.43 270 top
IC4  26.16,9.4 180 top
ICSP  7.62,50.8 90 top
JP2  16.51,73.66 270 top
JP3  64.77,55.88 90 top
L1  50.8,33.02 180 top
LED1  29.46,2.29 0 top
LED2  67.31,69.34 180 top
LOAD  44.45,5.08 0 top
N1  29.21,74.93 0 top
Q1  26.67,20 0 top
Q2  38.1,15.55 180 top
Q3  14.93,23.62 270 top
Q4  70.61,37.78 0 top
Q5  78.74,37.78 0 top
Q6  75.44,45.72 180 top
R1  30.48,6.6 180 top
R2  90.17,66.04 180 top
R3  90.17,62.23 180 top
R4  90.17,58.42 180 top
R5  90.17,54.61 180 top
R6  90.17,50.8 180 top
R7  9.14,27.94 0 top
R8  6.86,13.97 90 top
R9  80.01,17.02 270 top
R10  87.63,35.05 90 top
R11  89.66,35.05 90 top
R12  76.96,29.46 180 top
R13  4.57,40.39 0 top
R14  4.57,38.35 180 top
R15  4.57,32.26 180 top
R16  67.82,29.46 180 top
R17  72.14,54.36 0 top
R18  70.36,45.47 270 top
R19  72.9,65.02 0 top
R20  80.26,62.99 0 top
R21  35.81,4.32 0 top
R22  24.13,4.57 180 top
R23  80.26,65.02 0 top
R24  85.6,35.05 90 top
R25  24.13,2.54 180 top
R45  13.72,69.34 90 top
R46  7.37,58.42 180 top
R47  67.31,72.9 270 top
R48  11.68,69.34 90 top
SOLAR  7.62,5.08 0 top
TEMP  96.01,2.79 180 top
TP1  8.64,46.23 0 top
TP2  83.57,14.48 0 top
TP3  20.83,42.42 0 top
TP4  21.59,27.94 0 top
TP5  59.69,11.43 0 top
U1  MIC5205  [SOT23-5']  62.99,50.29 90 top
U2  46.99,57.15 90 top
X1  85.6,5.08 0 top
Y1  50.29,51.05 0 top

### Tracks (layer width: path | path; a pad name or v marks a point on that pad's centre or on a via)
+3V3  (via drill 0.5)
  Top 0.406: IC3.5 6.79,28.79 C14.1 8.64,30.23 10.16,31.75 10.16,40.64 13.97,44.45 v17.78,44.45 | C25.1 61.69,47.91 U1.5 | 49.02,61.41 U2.18 48.99,58.13 48.12,57.26 48.12,54.1 | U2.4 46.59,53.7 46.99,54.1 48.12,54.1 | 48.12,54.1 48.19,54.03 U2.6 48.19,51.3 C33.2 47.43,49.85 v48.26,49.02 | 2.54,58.42 2.54,52.07 3.81,50.8 ICSP.2 | 2.54,58.42 2.54,67.31 3.81,68.58 FTDI.4 6.79,70.29 R48.2 R45.2 13.72,70.87 JP2.1 | R46.2 2.54,58.42
  Top 0.61: v54.61,44.45 v17.78,44.45
  Top 0.813: C25.1 61.28,46.04 59.69,44.45 v54.61,44.45
  Bottom 0.406: v48.26,49.02 51.56,45.72 53.34,45.72 v54.61,44.45
  Bottom 0.61: v17.78,44.45 13.97,48.26 13.97,71.12 JP2.1
+3V3_BAT
  Top 0.305: C20.1 73.22,57.15 74.42,57.15 74.78,56.8 IC2.8
+12V  (via drill 0.5)  (1 unrouted)
  Top 0.305: IC4.1 27.37,7.4 | IC2.9 72.66,56.15 71.19,54.68 R17.1 C21.1 67.19,48.58 C29.1
  Top 0.406: 27.37,7.4 C6.1 27.86,6.11 D1.A 27.86,3.89 28.19,3.56 31.24,3.56 32.77,2.03 48.77,2.03 51.82,5.08 LOAD.2 | U1.1 65.05,48.58 C29.1
  Top 0.813: C29.1 66.04,45.72 64.52,44.2 64.52,26.67 F1.1A
  other vias: 51.56,6.35 51.56,5.08 51.56,3.81 56.39,3.81 56.39,5.08 56.39,6.35
  pour Top: 50.8,24.13 50.8,3.81 52.07,2.54 58.42,2.54 59.69,3.81 59.69,8.89 62.23,11.43 66.04,11.43 69.85,15.24 71.12,16.76 71.88,17.53 75.44,17.53 76.2,18.54 76.2,27.94 74.68,29.21 64.77,29.21 63.5,27.94 63.5,25.4 62.23,24.13
  pour Bottom: 50.8,2.54 49.53,3.81 49.53,6.35 59.18,16 66.8,16 69.34,18.8 69.34,25.15 73.66,29.21 77.47,29.21 78.74,27.94 78.74,20.32 68.58,10.16 62.23,10.16 58.42,6.35 58.42,3.81 57.15,2.54
A0
  Top 0.406: U2.23 44.99,66.77 43.18,68.58 JP2.3
A1
  Top 0.406: U2.24 44.19,65.03 43.18,66.04 JP2.4
A2
  Top 0.406: U2.25 40.38,59.95 36.83,63.5 JP2.5
A3
  Top 0.406: U2.26 39.91,59.15 38.1,60.96 JP2.6
A6  (via drill 0.5)
  Top 0.305: R13.1 3.62,41.47 4.06,41.91 10.16,41.91 13.97,45.72 36.07,45.72 40.64,50.29 v40.64,51.82 | U2.19 48.19,58.35 v46.99,57.15
  Top 0.406: R13.1 R14.2 C16.1
  Bottom 0.305: v40.64,51.82 40.64,53.34 44.45,57.15 v46.99,57.15
A7  (via drill 0.5)
  Top 0.305: C15.1 2.79,34.29 2.29,34.8 2.29,41.4 3.56,42.67 9.91,42.67 13.72,46.48 35.81,46.48 39.37,50.04 v39.37,51.82 | v45.79,58.42 U2.22
  Top 0.406: IC3.1 3.62,28.53 R15.2 C15.1
  Bottom 0.305: v39.37,51.82 39.37,53.34 44.45,58.42 v45.79,58.42
ALERT  (1 unrouted)
  Top 0.406: R20.2 81.74,62.47 IC2.20
AREF
  Top 0.406: C32.2 47.39,62.44 U2.20
BAT+  (via drill 0.5)
  other vias: 70.61,3.81 75.44,3.81 76.71,3.81 77.98,3.81
  pour Bottom: 71.12,2.54 69.85,3.81 69.85,5.08 75.18,10.41 81.53,10.41 83.82,12.7 83.82,17.78 81.28,20.32 81.28,29.21 82.55,30.48 91.44,30.48 92.71,29.21 92.71,12.7 82.55,2.54
  pour Top: 69.85,2.54 68.58,3.81 68.58,5.08 72.64,9.14 81.53,9.14 86.36,13.97 86.36,29.21 87.63,30.48 91.44,30.48 92.71,29.21 92.71,16.51 78.74,2.54
CHG
  Top 0.305: Q6.2 76.71,49.04 76.71,52.32 77.72,53.34 77.72,54.86 78.99,56.13 78.99,59.94 78.23,60.71 75.75,60.71 IC2.2
D2
  Top 0.406: R20.1 78.23,62.99 77.47,62.23 76.2,62.23 74.93,63.5 69.34,63.5 68.58,62.74 68.58,54.61 66.8,52.83 59.18,52.83 52.07,45.72 44.2,45.72 42.93,46.99 42.93,54.12 U2.32
D3
  Top 0.406: JP3.1 59.18,55.88 54.61,51.31 54.61,49.28 52.07,46.74 44.45,46.74 43.69,47.5 43.69,52.35 U2.1
D4
  Top 0.406: JP3.2 60.45,58.42 53.59,51.56 53.59,49.53 51.82,47.75 44.7,47.75 44.45,48.01 44.45,51.56 44.99,52.1 U2.2
D5
  Top 0.406: JP3.3 61.47,60.96 54.86,54.35 U2.9
D6
  Top 0.406: JP3.4 62.74,63.5 54.39,55.15 U2.10
D7  (via drill 0.5)
  Top 0.406: R19.1 68.33,65.02 67.31,64.01 67.31,54.86 66.29,53.85 62.99,53.85 v62.23,54.61 | U2.11 52.14,55.95 57.15,60.96 v58.42,60.96
  Bottom 0.406: v62.23,54.61 62.23,57.15 v58.42,60.96
D8  (via drill 0.5)
  Top 0.305: IC4.7 v22.86,9.91 | v2.54,43.18 2.79,43.43 9.4,43.43 13.21,47.24 35.05,47.24 v38.35,50.55 | v49.53,54.61 49.53,55.88 50.4,56.75 U2.12
  Bottom 0.305: v22.86,9.91 22.86,2.54 22.35,2.03 3.3,2.03 2.54,2.79 2.54,8.89 5.08,11.43 5.08,15.24 2.54,17.78 v2.54,43.18 | v38.35,50.55 41.66,50.55 45.72,54.61 v49.53,54.61
D9  (via drill 0.5)
  Top 0.305: IC4.8 25.65,9.4 v26.42,8.64 | R25.2 24.45,1.27 v26.67,1.27 | U2.13 49.93,57.55 v49.53,57.15 | v41.91,53.09 39.37,53.09 34.29,48.01 12.95,48.01 10.41,45.47 9.4,44.45 2.03,44.45 1.52,43.94 v1.52,28.19
  Top 0.406: TP1.TP 9.65,46.23 10.41,45.47
  Bottom 0.305: v26.42,8.64 25.4,7.62 25.4,2.54 24.13,1.27 | 24.13,1.27 3.05,1.27 1.78,2.54 1.78,9.14 4.32,11.68 4.32,14.99 1.52,17.78 v1.52,28.19 | v26.67,1.27 24.13,1.27 | v41.91,53.09 43.43,53.09 45.47,55.12 47.5,55.12 v49.53,57.15
D10
  Top 0.406: U2.14 53.27,58.35 60.96,66.04 JP3.5
D_LS
  Top 0.305: IC4.4 30.03,9.9 C5.2
  Top 0.406: Q2.4 38.1,10.16 38.78,9.48 38.78,5.08 R21.2
  pour Top: 26.67,17.53 26.67,12.19 28.45,12.19 29.72,10.92 29.72,9.4 42.67,9.4 45.72,12.45 45.72,13.46 46.74,14.48 48.77,14.48 49.53,15.24 49.53,24.13 41.91,24.13 41.91,17.53
DCDC_IN
  pour Top: 11.43,40.64 11.43,29.21 12.7,27.94 12.7,19.81 26.67,19.81 26.67,18.29 31.75,18.29 31.75,29.97 30.48,30.48 27.94,33.02 27.94,40.64 26.67,41.91 12.7,41.91
DSG  (via drill 0.5, 0.5 pad 0.81)
  Top 0.305: v82.55,44.45 80.77,46.23 80.01,46.23 77.47,48.77 77.47,52.07 78.23,52.83 78.23,54.61 79.5,55.88 79.5,60.45 78.61,61.34 IC2.1
  Top 0.406: R12.2 76.01,32.03 Q5.1 76.71,32.48 v76.71,34.8
  Bottom 0.406: v76.71,34.8 82.8,34.8 83.82,35.81 83.82,43.18 v82.55,44.45
DTR
  Top 0.406: C31.2 6.28,62.16 FTDI.1
GND  (via drill 0.5, 0.6)
  Top 0.305: C8.1 C9.2 | C28.2 81.53,48.77 v81.03,48.26 80.26,48.26 79.5,49.02 C27.2 79.5,49.28 | Q6.1 76.47,46.74 v77.72,46.74 | IC2.3 74.25,60.05 C17.2 | C32.1 46.23,63.31 v46.23,64.77
  Top 0.406: IC3.2 4.57,27.43 5.08,27.94 5.08,30.04 C14.2 4.89,31.63 R15.1 | R15.1 C15.2 C16.2 R14.1 | R15.1 5.78,32 v7.11,32 | R9.2 80.01,15.75 80.77,16.51 84.58,16.51 85.34,17.27 85.34,29.46 87.38,31.5 89.15,31.5 89.66,32 R11.1 | v83.57,64.01 84.26,64.01 C9.2 | C29.2 66.04,50.29 U1.2 63.75,50.29 63.25,49.78 63.25,47.5 C25.2 | Y1.2 50.29,49.53 v50.04,49.28 | R23.1 C26.2 77.66,66.36 v77.22,66.8 | U2.3 45.79,51.56 | 45.79,51.56 45.79,50.8 C33.1 45.53,49.09 v45.47,49.02 | U2.5 47.39,51.96 47.24,51.82 46.04,51.82 45.79,51.56 | LED2.C v67.31,67.06 | C32.1 46.59,62.95 U2.21
  Top 0.61: C17.2 C20.2 | v67.56,50.8 67.24,50.48 C29.2 | 63.25,47.5 64.26,47.5 v64.77,46.99
  Bottom 0.406: TEMP.2 94.74,9.4 93.73,10.41 93.73,45.97 92.71,46.99 85.09,46.99
  Bottom 0.813: 85.09,46.99 85.09,35.56 80.01,30.48 v80.01,11.94
  other vias: 73.66,50.04 73.91,61.72 72.64,61.72 66.04,3.81 81.28,11.94 75.95,14.73 77.22,14.73 60.96,3.81 60.96,6.35 60.96,5.08 66.04,5.08 66.04,6.35 78.74,11.94
  pour Bottom: 2.54,78.74 93.98,78.74 93.98,45.97 11.43,45.72 8.89,45.72 7.62,44.45 7.62,30.48 2.54,30.48
  pour Top (no thermals): 70.61,59.69 75.95,59.69 75.95,60.96 74.93,61.72 74.93,62.48 70.61,62.48
  pour Top (no thermals): 72.64,52.07 76.2,52.07 76.2,49.02 72.64,49.02
  pour Top: 60.45,3.81 61.72,2.54 66.04,2.54 67.31,3.81 67.31,5.08 72.39,10.16 81.28,10.16 82.55,11.43 82.55,15.24 71.12,15.24 66.55,10.67 62.74,10.67 60.45,8.38
  pour Bottom: 62.23,8.89 68.58,8.89 76.2,16.51 82.55,16.51 82.55,12.7 81.28,11.43 74.93,11.43 68.58,5.08 68.58,3.81 67.31,2.54 60.96,2.54 59.69,3.81 59.69,6.35
MISO  (via drill 0.5)
  Top 0.406: JP3.7 63.5,71.12 52.33,59.95 U2.16 52.07,60.74 v52.07,60.96 | ICSP.1 13.21,50.8 13.97,50.04 34.8,50.04 v38.86,54.1
  Bottom 0.406: v38.86,54.1 44.45,59.69 50.8,59.69 v52.07,60.96
MOSI  (via drill 0.5)
  Top 0.406: U2.15 52.8,59.15 62.23,68.58 JP3.6 63.5,67.31 v62.23,67.31 | v2.54,69.85 2.54,73.41 5.33,76.2 17.78,76.2 24.13,69.85 v53.34,69.85
  Bottom 0.406: ICSP.4 2.54,55.88 v2.54,69.85 | v53.34,69.85 59.69,69.85 v62.23,67.31
N$1
  Top 0.305: R8.2 6.86,15.49 6.6,15.24 3.56,15.24 3.05,15.75 3.05,23.88 5.65,26.48 IC3.4 6.74,26.48 R7.1
  pour Top: 11.68,22.61 10.16,24.13 5.08,24.13 4.06,22.86 4.06,16 9.4,16 9.4,18.29 10.16,19.05 11.68,19.05
N$2
  Top 0.305: 23.95,8.38 IC4.10 22.37,8.4 22.35,8.38
  Top 0.406: 22.35,8.38 21.84,8.89 21.84,10.41 22.61,11.18 25.15,11.18 25.91,11.94 25.91,16.76 26.67,17.53 33.27,17.53 33.78,18.03 39.88,18.03 40.39,18.54 Q2.1
N$3
  Top 0.406: R47.2 LED2.A
N$4  (via drill 0.5)
  Top 0.305: IC4.3 27.43,9.4 26.92,9.91 v26.92,10.67
  Top 0.406: D2.A 23.62,18.8 23.62,15.46 Q1.1 24.13,14.44 v24.13,12.45
  Bottom 0.406: v26.92,10.67 25.15,12.45 v24.13,12.45
N$5
  Top 0.305: IC4.2 28.95,8.9 29.21,8.64 29.21,6.92 R1.2
  Top 0.406: R1.2 30.06,6.08 D1.C
N$6
  Top 0.305: R16.2 66.87,31.01 Q4.1
  Top 0.406: Q4.1 68.33,33.27 67.31,34.29 66.04,34.29 65.53,34.8 65.53,43.37 66.11,43.94 66.8,43.94 67.06,44.2 67.06,45.97 67.5,46.42 C23.1 R18.1 70.36,46.57 D5.C
N$7
  Top 0.406: X1.P$2 88.1,6.82 96.27,14.99 96.27,61.47 95.5,62.23 R3.1
N$8
  Top 0.406: C5.1 31.43,7.5 R1.1
N$9
  Top 0.305: IC2.10 75.18,54.94 C22.1 73.21,54.23 R17.2
N$10  (1 unrouted)
  Top 0.305: C10.1 84.47,58.09 IC2.15
  Top 0.406: C10.1 87.37,57.47 R4.2
N$11
  Top 0.305: IC2.13 82.4,56.8 83.06,56.13 83.06,54.86 84.26,53.66 C11.1
  Top 0.406: IC2.14 IC2.13 | C12.2 C11.1 87.37,53.66 R5.2
N$12
  Top 0.406: X1.P$1 90.6,8.05 97.03,14.48 97.03,64.77 95.76,66.04 R2.1
N$13
  Top 0.305: C12.1 84.77,49.85 83.82,50.8 83.82,53.34 82.55,54.61 82.55,55.88 82.28,56.15 IC2.12
  Top 0.406: C12.1 87.37,49.85 R6.2
N$14
  Top 0.305: C8.2 83.5,66.99 82.55,66.04 82.55,59.69 82.25,59.4 IC2.17
  Top 0.406: C8.2 87.37,66.99 R2.2
N$15
  Top 0.406: 92.71,58.42 R4.1 95,58.42 95.5,57.91 95.5,15.49 85.6,5.59 X1.P$3
N$16
  Top 0.305: IC2.16 83.13,58.74 83.82,59.44 83.82,60.96 84.14,61.28 C9.1 C10.2
  Top 0.406: C9.1 87.37,61.28 R3.2
N$17
  Top 0.406: X1.P$4 83.82,5.08 94.74,16 94.74,53.85 93.98,54.61 R5.1
N$18
  Top 0.406: R18.2 70.51,44.37 D5.A 75.18,44.37 arc90 Q6.3
N$19
  Top 0.305: R7.2 10.09,25.97 10.17,25.9
  Top 0.406: D2.C 12.95,18.8 12.45,19.3 12.45,23.62 10.17,25.9 Q3.1
N$20
  Top 0.406: Y1.3 51.49,51.89 50.55,52.83 49.81,52.83 U2.8
N$21
  Top 0.406: U2.7 48.99,51.16 Y1.1
N$22
  Top 0.406: R9.1 80.01,18.29 80.77,17.53 84.07,17.53 84.58,18.03 84.58,29.97 87.63,33.02 R10.1 | R24.1 85.41,34.29 83.82,34.29 82,32.48 Q5.3
  pour Top: 77.47,19.05 83.82,19.05 83.82,35.05 77.47,35.05
N$23
  Top 0.406: C23.2 68.33,43.43 arc90 68.58,43.18 70.61,43.18 Q4.4
  pour Top: 66.29,43.18 83.82,43.18 83.82,36.07 75.69,36.07 75.44,35.81 66.29,35.81
N$24  (via drill 0.5)
  Top 0.305: R22.2 23.88,5.27 v23.88,7.37 | IC4.6 v25.64,10.4
  Bottom 0.305: v23.88,7.37 25.65,9.14 25.64,9.16 v25.64,10.4
N$25
  Top 0.406: X1.P$5 81.87,6.35 83.82,6.35 93.98,16.51 93.98,49.79 R6.1 92.71,50.54 92.71,50.04
N$26
  Top 0.305: C17.1 74.95,57.45 IC2.7
N$27
  Top 0.406: R21.1 33.34,4.59 C7.1
N$28
  Top 0.305: R25.1 25.33,2.29 LED1.A
NTC  (via drill 0.5)
  Top 0.305: R19.2 C26.1
  Top 0.406: v77.47,56.39 77.47,57.4 76.78,58.09 IC2.6 | 76.2,64.84 76.2,64.77 | 76.2,64.77 76.2,63.75 v76.45,63.5 | 76.2,64.77 75.95,65.02 C26.1 76.2,65.47 76.2,67.31 77.47,68.58 v93.98,68.58
  Bottom 0.406: TEMP.1 97.28,8.13 94.49,10.92 94.49,68.07 v93.98,68.58 | v76.45,63.5 78.99,60.96 78.99,57.4 77.98,56.39 v77.47,56.39
PGND  (via drill 0.5)
  Top 0.305: 68.77,29.65 69.28,29.65 v70.61,30.99 | IC4.9 24.89,8.89 25.47,8.32 C6.2
  Top 0.406: v26.67,5.08 26.67,5.4 C6.2 | R22.1 26.35,3.3 v26.67,3.3 | R16.1 68.77,29.65 | R24.2 76.39,36 74.68,34.29 74.93,34.04 v74.42,33.53
  other vias: 21.84,12.7 37.85,21.84 37.85,20.57 37.85,19.3 34.04,19.81 33.02,19.05 21.84,13.97 21.84,15.24 21.84,16.51 36.58,6.86 36.58,8.13 46.99,11.43 46.99,12.7 46.99,10.16 41.91,3.81 41.91,6.35 46.99,6.35 14.73,3.81 19.56,3.81 19.56,6.35 14.73,6.35 46.99,3.81 70.61,32.26 70.61,33.53 74.42,30.99 74.42,32.26 41.91,5.08 46.99,5.08 14.73,5.08 19.56,5.08
  pour Top (no thermals): 38.86,38.1 37.59,39.37 30.48,39.37 29.21,38.1 29.21,34.29 33.02,30.48 33.02,20.07 32.51,19.56 32.51,18.29 38.86,18.29
  pour Bottom: 13.97,2.54 20.32,2.54 21.59,3.81 21.59,10.16 22.86,11.43 26.67,11.43 26.67,7.62 25.4,6.35 25.4,3.81 26.67,2.54 46.99,2.54 48.26,3.81 48.26,6.35 58.67,16.76 66.29,16.76 68.58,19.05 68.58,25.4 73.41,29.97 76.2,29.97 76.2,36.83 66.04,36.83 62.23,33.02 62.23,26.67 60.96,25.4 36.83,25.4 34.29,27.94 34.29,41.91 33.02,43.18 12.7,43.18 11.43,41.91 11.43,29.21 12.7,27.94 12.7,3.81
  pour Top: 16.51,17.78 22.86,17.78 22.86,11.43 21.59,10.16 21.59,3.81 20.32,2.54 15.24,2.54 13.97,3.81 13.97,8.89 16.51,11.43
  pour Top (no thermals): 35.56,8.64 37.59,8.64 37.59,6.1 35.56,6.1
  pour Top: 40.64,3.05 40.64,6.35 46.48,12.19 46.48,13.21 46.99,13.72 50.04,13.72 49.78,4.57 48.26,3.05
  pour Top: 69.6,34.8 75.18,34.8 75.18,29.97 69.6,29.97
RESET  (via drill 0.5)
  Top 0.406: C31.1 8.38,58.49 R46.1 8.32,56.58 ICSP.5 10.92,55.88 14.73,52.07 19.3,52.07 20.07,52.83 v27.43,52.83 | U2.29 31.35,56.75 v30.48,55.88
  Bottom 0.406: v30.48,55.88 v27.43,52.83
RXI
  Top 0.406: FTDI.3 10.16,66.04 11.43,64.77 11.43,58.42 15.75,54.1 18.54,54.1 19.05,54.61 31.24,54.61 32.58,55.95 U2.30
SCK  (via drill 0.5)
  Top 0.406: R47.1 67.31,73.66 JP3.8 59.69,73.66 49.79,63.76 U2.17 50.58,62.23 v50.8,62.23 | ICSP.3 11.94,53.34 14.22,51.05 33.78,51.05 v36.83,54.1
  Bottom 0.406: v36.83,54.1 44.96,62.23 v50.8,62.23
SCL  (via drill 0.5)
  Top 0.406: IC2.5 77.65,58.74 v77.98,58.42 | v73.66,67.31 74.93,67.31 76.2,68.58 76.2,72.39 71.37,77.22 56.9,77.22 52.07,72.39 27.94,72.39 v26.67,71.12 | U2.28 29.61,57.55 27.94,55.88 v25.4,55.88 JP2.8 12.7,59.69 12.7,66.04 11.68,67.06 R48.1
  Bottom 0.406: v77.98,58.42 77.22,58.42 76.2,59.44 76.2,60.96 73.66,63.5 v73.66,67.31 | v26.67,71.12 25.4,69.85 v25.4,55.88
SDA  (via drill 0.5)
  Top 0.406: IC2.4 77.17,59.4 v77.47,59.69 | v74.93,69.34 74.93,72.39 71.12,76.2 57.15,76.2 52.07,71.12 v29.21,71.12 | U2.27 42.63,58.42 v27.94,58.42 JP2.7 13.72,61.21 R45.1
  Bottom 0.406: v77.47,59.69 77.47,60.96 74.93,63.5 v74.93,69.34 | v29.21,71.12 27.94,69.85 v27.94,58.42
SOLAR+  (via drill 0.5)
  Top 0.305: IC3.3 2.86,26.48 2.29,25.91 2.29,15.75 3.56,14.48 6.35,14.48 6.86,13.97 R8.1 | R13.2 7.87,40.39 v8.89,39.37
  Bottom 0.305: v8.89,39.37 8.89,8.89 7.62,7.62 SOLAR.1
  other vias: 10.16,6.35 10.16,5.08 10.16,3.81 5.08,3.81 5.08,5.08 5.08,6.35 9.4,11.94 10.92,17.02
  pour Top: 5.08,2.54 3.81,3.81 3.81,11.94 8.89,11.94 10.16,13.21 10.16,17.78 15.24,17.78 15.24,12.7 12.7,10.16 12.7,3.81 11.43,2.54
  pour Bottom: 3.81,17.78 11.43,17.78 11.43,3.81 10.16,2.54 5.08,2.54 3.81,3.81
SRN
  Top 0.305: R10.2 87.63,42.67 83.06,47.24 80.01,47.24 78.23,49.02 78.23,51.31 78.67,51.75 C27.1 79.5,53.53 C13.1 80.01,54.04 80.01,60.2 80.51,60.7 IC2.19
SRP
  Top 0.305: R11.2 89.66,41.91 83.06,48.51 83.06,51.31 82.62,51.75 C28.1 81.53,53.53 C13.2 81.47,53.91 80.52,54.86 80.52,59.69 80.87,60.05 IC2.18
TXO
  Top 0.406: FTDI.2 9.65,63.5 10.41,62.74 10.41,57.91 15.24,53.09 18.8,53.09 19.56,53.85 32,53.85 33.31,55.15 U2.31

### Text on the board
tNames: D13/SCK | GND | VCC | D12/MISO | GND | GND | ~D11/MOSI | R2-6 | VCC | A0 | C8- / 12 | ~D10/SS | RX | A1 | ~D6 | TX | A2 | ~D5 | A3 | D4 | SDA | ~D3 | SCL
tDocu: REsolut / Solarduino | Design: Martin Jäger / m.jaeger@posteo.de / License: CC BY-SA | V0.3 11/2015 | + - | - + | - + | 4 3 2 1 0
bDocu: - + | + - | + -